# EAGLE schematic breadboarder (EAGLE 6.5.0)
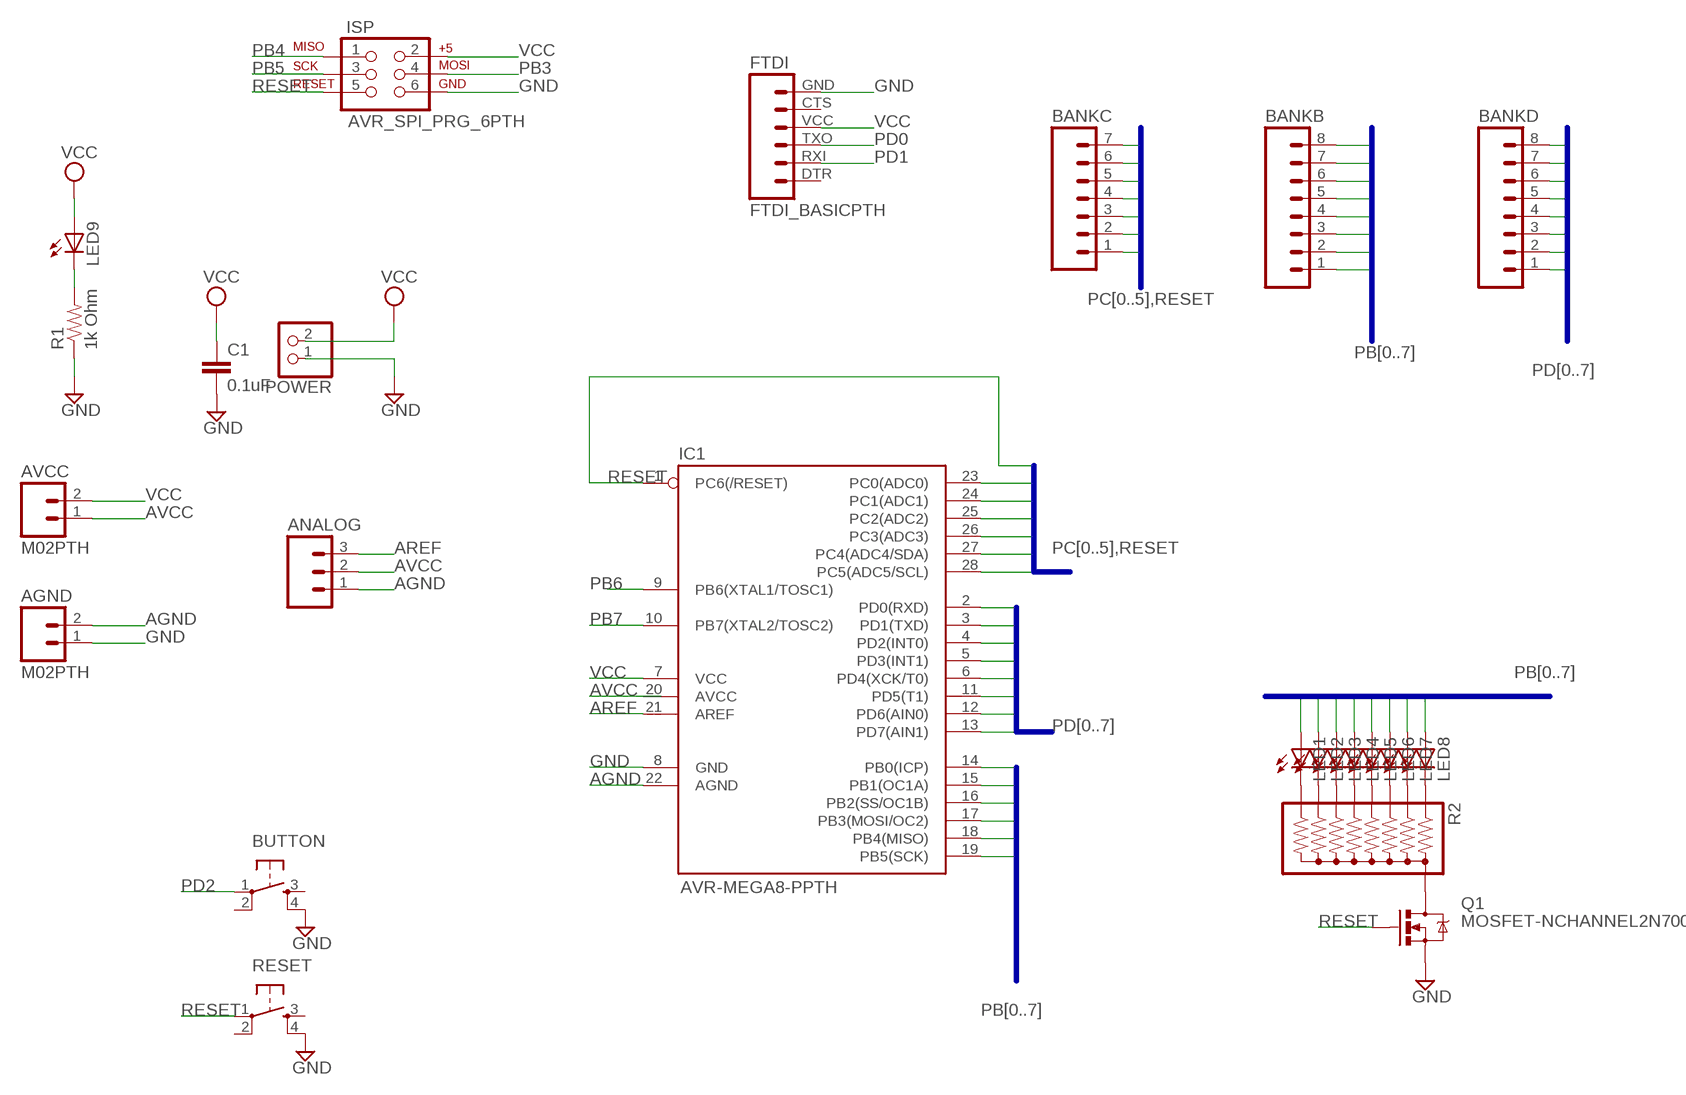
[diagram p0: schematic, sheet 1]

## Parts
AGND  M02PTH  [1X02]
ANALOG  M03LONGPADS  [1X03_LONGPADS]
AVCC  M02PTH  [1X02]
BANKB  M08LONGPADS  [1X08_LONGPADS]
BANKC  M07LONGPADS  [1X07_LONGPADS]
BANKD  M08LONGPADS  [1X08_LONGPADS]
BUTTON  TAC_SWITCHPTH  [TACTILE-PTH]
C1  0.1uF  CAPKIT  [CAP-PTH-SMALL-KIT]
FTDI  FTDI_BASICPTH  [FTDI_BASIC]
IC1  AVR-MEGA8-PPTH  [DIL28-3]
ISP  AVR_SPI_PRG_6PTH  [2X3]
LED1  LED3MM  [LED3MM]
LED2  LED3MM  [LED3MM]
LED3  LED3MM  [LED3MM]
LED4  LED3MM  [LED3MM]
LED5  LED3MM  [LED3MM]
LED6  LED3MM  [LED3MM]
LED7  LED3MM  [LED3MM]
LED8  LED3MM  [LED3MM]
LED9  LED3MM  [LED3MM]
POWER  PINHD-1X2  [1X02]
Q1  MOSFET-NCHANNEL2N7000  [TO-92]
R1  1k Ohm  RESISTORAXIAL-0.3  [AXIAL-0.3]
R2  RPACK-BUSSED-8SIP-PTH-8-LP  [RPACK-SIP-PTH-8-LP]
RESET  TAC_SWITCHPTH  [TACTILE-PTH]

## Nets
AGND: AGND.2 ANALOG.1 IC1.22(AGND)
AREF: ANALOG.3 IC1.21(AREF)
AVCC: ANALOG.2 AVCC.1
GND: AGND.1 BUTTON.4 C1.2 FTDI.GND IC1.8(GND) ISP.6 POWER.1 Q1.1(S) R1.P$1 RESET.4
N$1: Q1.3(D) R2.P$1
N$2: LED1.K(C) R2.P$9
N$3: LED2.K(C) R2.P$8
N$4: LED3.K(C) R2.P$7
N$5: LED4.K(C) R2.P$6
N$6: LED5.K(C) R2.P$5
N$7: LED6.K(C) R2.P$4
N$8: LED7.K(C) R2.P$3
N$9: LED8.K(C) R2.P$2
N$10: LED9.K(C) R1.P$2
PB0: BANKB.8 IC1.14(PB0(ICP)) LED1.A
PB1: BANKB.7 IC1.15(PB1(OC1A)) LED2.A
PB2: BANKB.6 IC1.16(PB2(SS/OC1B)) LED3.A
PB3: BANKB.5 IC1.17(PB3(MOSI/OC2)) ISP.4 LED4.A
PB4: BANKB.4 IC1.18(PB4(MISO)) ISP.1 LED5.A
PB5: BANKB.3 IC1.19(PB5(SCK)) ISP.3 LED6.A
PB6: BANKB.2 IC1.9(PB6(XTAL1/TOSC1)) LED7.A
PB7: BANKB.1 IC1.10(PB7(XTAL2/TOSC2)) LED8.A
PC0: BANKC.7 IC1.23(PC0(ADC0))
PC1: BANKC.6 IC1.24(PC1(ADC1))
PC2: BANKC.5 IC1.25(PC2(ADC2))
PC3: BANKC.4 IC1.26(PC3(ADC3))
PC4: BANKC.3 IC1.27(PC4(ADC4/SDA))
PC5: BANKC.2 IC1.28(PC5(ADC5/SCL))
PD0: BANKD.8 FTDI.TXO IC1.2(PD0(RXD))
PD1: BANKD.7 FTDI.RXI IC1.3(PD1(TXD))
PD2: BANKD.6 BUTTON.1 IC1.4(PD2(INT0))
PD3: BANKD.5 IC1.5(PD3(INT1))
PD4: BANKD.4 IC1.6(PD4(XCK/T0))
PD5: BANKD.3 IC1.11(PD5(T1))
PD6: BANKD.2 IC1.12(PD6(AIN0))
PD7: BANKD.1 IC1.13(PD7(AIN1))
RESET: BANKC.1 IC1.1(PC6(/RESET)) ISP.5 Q1.2(G) RESET.1
VCC: AVCC.2 C1.1 FTDI.VCC IC1.7(VCC) ISP.2 LED9.A POWER.2
Unconnected: BUTTON.2 BUTTON.3 FTDI.CTS FTDI.DTR IC1.20(AVCC) RESET.2 RESET.3

## Buses
PC[0..5],RESET
PB[0..7]
PD[0..7]

## Library data of the parts
AGND AVCC = SparkFun-Connectors:M02: Standard 2-pin 0.1" header. Use with - straight break away headers ( PRT-00116) - right angle break away headers (PRT-00553) - swiss pins (PRT-00743) - machine pins (PRT-00117) - female headers (PRT-00115) Molex polarized connector foot print use with: PRT-08233 with associated crimp pins and housings. 2.54_SCREWTERM for use with PRT-10571. 3.5mm Screw Terminal footprints for PRT-08084 5mm Screw Terminal footprints for use with PRT-08433
ANALOG = SparkFun-Connectors:M03: Header 3 Standard 3-pin 0.1" header. Use with straight break away headers (SKU : PRT-00116), right angle break away headers (PRT-00553), swiss pins (PRT-00743), machine pins (PRT-00117), and female headers (PRT-00115). Molex polarized connector foot print use with SKU : PRT-08232 with associated crimp pins and housings.
BANKB BANKD = SparkFun-Connectors:M08: Header 8 Standard 8-pin 0.1" header. Use with straight break away headers (SKU : PRT-00116), right angle break away headers (PRT-00553), swiss pins (PRT-00743), machine pins (PRT-00117), and female headers (PRT-00115).
BANKC = SparkFun-Connectors:M07: Header 7 Standard 7-pin 0.1" header. Use with straight break away headers (SKU : PRT-00116), right angle break away headers (PRT-00553), swiss pins (PRT-00743), machine pins (PRT-00117), and female headers (PRT-00115). NOTES ON THE VARIANTS LOCK and LOCK_LONGPADS... This footprint was designed to help hold the alignment of a through-hole component (i.e. 7-pin header) while soldering it into place. You may notice that each hole has been shifted either up or down by 0.005 of an inch from it's more standard position (which is usually a perfectly straight line). This slight alteration caused the pins (the squares in the middle) to touch the edges of the holes. Because they are alternating, it causes a "brace" to hold the header in place. 0.005 has proven to be the perfect amount of "off-center" position when using our standard breakaway headers. Although looks a little odd when you look at the bare footprint, once you have a header in there, the alteration is very hard to notice. Also, if you push a header all the way into place, it is covered up entirely on the bottom side. This idea of altering the position of holes to aid alignment will be further integrated into the Sparkfun Library for other footprints. It can help hold any component with 3 or more connection pins.
BUTTON RESET = SparkFun-Electromechanical:TAC_SWITCH: Momentary Switch Button commonly used for reset or general input. Spark Fun Electronics SKU : COM-00097 SMT- SWCH-08247
C1 = SparkFun-Capacitors:CAP: Capacitor Standard 0603 ceramic capacitor, and 0.1" leaded capacitor.
FTDI = SparkFun-Connectors:FTDI_BASIC: FTDI Basic header with labels
IC1 = SparkFun-DigitalIC:AVR-MEGA8-P: MICROCONTROLLER 8 Kbytes FLASH 1 kbytes SRAM 512 bytes EEPROM USART 4-channel 10 bit ADC 2-channel 8 bit ADC
ISP = SparkFun-Connectors:AVR_SPI_PRG_6: AVR ISP 6 Pin This is the reduced ISP connector for AVR programming. Common on Arduino. This footprint will take up less PCB space and can be used with a 10-pin to 6-pin adapter such as SKU: BOB-08508
LED1-LED9 = SparkFun-LED:LED: LEDs Standard schematic elements and footprints for 5mm, 3mm, 1206, and 0603 sized LEDs. 5mm - Spark Fun Electronics SKU : COM-00529 (and others)
POWER = pinhead:PINHD-1X2: PIN HEADER
Q1 = SparkFun-DiscreteSemi:MOSFET-NCHANNEL: Common NMOSFET Parts MFG P/N Store ID Prod ID FDD8780 TRANS-09984 SI7820DN TRANS-11055 FDS6630A IC-08089 2N7002PW TRANS-11151 FQP30N06L COM-10213 TRANS-10060 BSS123LT1G TRANS-08345 BSS138 TRANS-00830 BS170 2N7000
R1 = SparkFun-Passives:RESISTOR: Resistor Basic schematic elements and footprints for 0603, 1206, and PTH resistors.
R2 = SparkFun-Resistors:RPACK-BUSSED-8: BOURNS 4600X/R series thick-film SIP resistor packs Height resistors bussed to a single pin (denoted by dot). datasheet <http://dlnmh9ip6v2uc.cloudfront.net/datasheets/Components/General/4600x.pdf> SIMILAR TO: SFE parts COM-10855 (330), COM-10856 (10K)